# EAGLE design 150HzLPF_8GainPreamp (EAGLE 9.4.1)
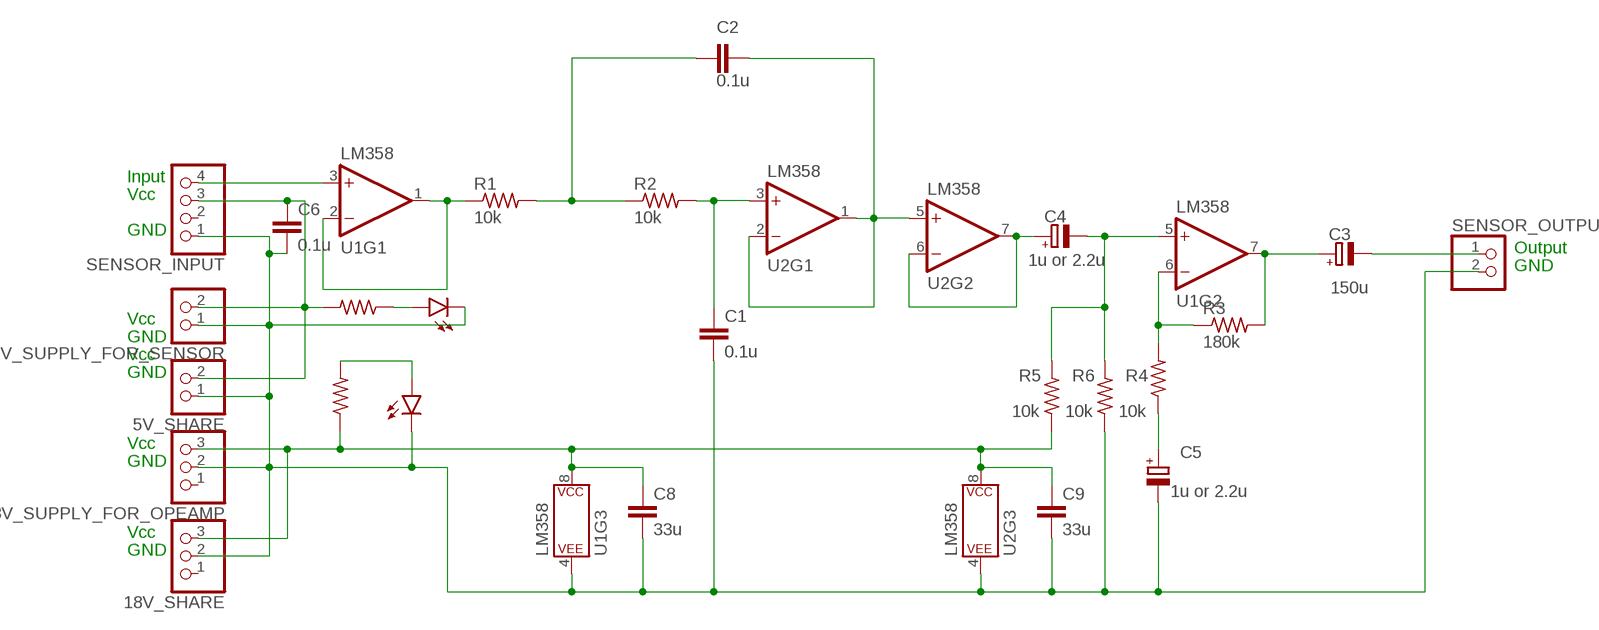
[diagram p0: schematic, sheet 1]

## Parts
5V_SHARE  PINHD-1X2  [1X02]
5V_SUPPLY_FOR_SENSOR  PINHD-1X2  [1X02]
18V_SHARE  PINHD-1X3  [1X03]
18V_SUPPLY_FOR_OPEAMP  PINHD-1X3  [1X03]
C1  0.1u  C-EU050-030X075  [C050-030X075]
C2  0.1u  C-EU050-030X075  [C050-030X075]
C3  150u  CPOL-EUE5-10.5  [E5-10,5]
C4  1u or 2.2u  CPOL-EUE5-10.5  [E5-10,5]
C5  1u or 2.2u  CPOL-EUE5-10.5  [E5-10,5]
C6  0.1u  C-EUC0603  [C0603]
C8  33u  C-EUC0603  [C0603]
C9  33u  C-EUC0603  [C0603]
D2  LTL-1CHE  [RADIAL_3MM]
D3  LTL-1CHE  [RADIAL_3MM]
R1  10k  R-US_0207/7  [0207/7]
R2  10k  R-US_0207/7  [0207/7]
R3  180k  R-US_0207/7  [0207/7]
R4  10k  R-US_0207/7  [0207/7]
R5  10k  R-US_0207/7  [0207/7]
R6  10k  R-US_0207/7  [0207/7]
R8  760  R-US_0207/7  [0207/7]
R9  3.3k  R-US_0207/7  [0207/7]
SENSOR_INPUT  PINHD-1X4  [1X04]
SENSOR_OUTPUT  PINHD-1X2  [1X02]
U1  LM358  [DIP08]
U2  LM358  [DIP08]

## Nets
5V_VCC: 5V_SHARE.2 5V_SUPPLY_FOR_SENSOR.2 C6.1 R8.2 SENSOR_INPUT.3
18V_VCC: 18V_SHARE.3 18V_SUPPLY_FOR_OPEAMP.3 C8.1 C9.1 R5.1 R9.1 U1.8(P$V+) U2.8(P$V+)
GND: 5V_SHARE.1 5V_SUPPLY_FOR_SENSOR.1 18V_SHARE.2 18V_SUPPLY_FOR_OPEAMP.2 C1.2 C5.- C6.2 C8.2 C9.2 D2.C D3.C R6.1 SENSOR_INPUT.1 SENSOR_OUTPUT.2 U1.4(P$V-) U2.4(P$V-)
N$1: R1.1 U1.1(OUT) U1.2(-IN)
N$2: C2.2 R1.2 R2.1
N$3: C1.1 R2.2 U2.3(+IN)
N$4: C2.1 U2.1(OUT) U2.2(-IN) U2.5(+IN)
N$5: SENSOR_INPUT.4 U1.3(+IN)
N$7: C4.+ U2.6(-IN) U2.7(OUT)
N$8: R3.1 R4.2 U1.6(-IN)
N$9: C3.+ R3.2 U1.7(OUT)
N$10: C4.- R5.2 R6.2 U1.5(+IN)
N$11: C5.+ R4.1
N$12: D2.A R8.1
N$13: C3.- SENSOR_OUTPUT.1
N$16: D3.A R9.2
Unconnected: 18V_SHARE.1 18V_SUPPLY_FOR_OPEAMP.1 SENSOR_INPUT.2

## Notes on the sheet
- Input
- Vcc
- GND
- Output
- GND
- Vcc
- GND
- Vcc
- GND
- Vcc
- GND
- Vcc
- GND

## Library data of the parts
5V_SHARE 5V_SUPPLY_FOR_SENSOR SENSOR_OUTPUT = pinhead:PINHD-1X2: PIN HEADER
18V_SHARE 18V_SUPPLY_FOR_OPEAMP = pinhead:PINHD-1X3: PIN HEADER
C1 C2 C6 C8 C9 = rcl:C-EU: CAPACITOR, European symbol; SPICEPREFIX: C
C3-C5 = rcl:CPOL-EU: POLARIZED CAPACITOR, European symbol; SPICEPREFIX: C
D2 D3 = LED:LTL-1CHE: LED RED DIFFUSED T/H Manufacturer's datasheet <https://media.digikey.com/pdf/Data%20Sheets/Lite-On%20PDFs/LTL-1CHEE.pdf>; CREATED_BY: PCBLayout.com; DIGIKEY_PART_NUMBER: 160-1708-ND; MANUFACTURER: Lite-On Inc.; MPN: LTL-1CHE; PACKAGE: RADIAL 3MM
R1-R6 R8 R9 = rcl:R-US_: RESISTOR, American symbol; SPICEPREFIX: R
SENSOR_INPUT = pinhead:PINHD-1X4: PIN HEADER
U1 U2 = SparkFun-IC-Amplifiers:LM358: LM358 Jellybean op-amp Datasheet <http://www.sparkfun.com/datasheets/Components/General/LM358.pdf> SparkFun Products Op-Amp (Thru-Hole) - LM358 <https://www.sparkfun.com/products/9456> (COM-09456); PROD_ID: IC-09172

## Net classes
0 default: width 0.8 mm, drill 0.2 mm, clearance 0.3 mm

## Board
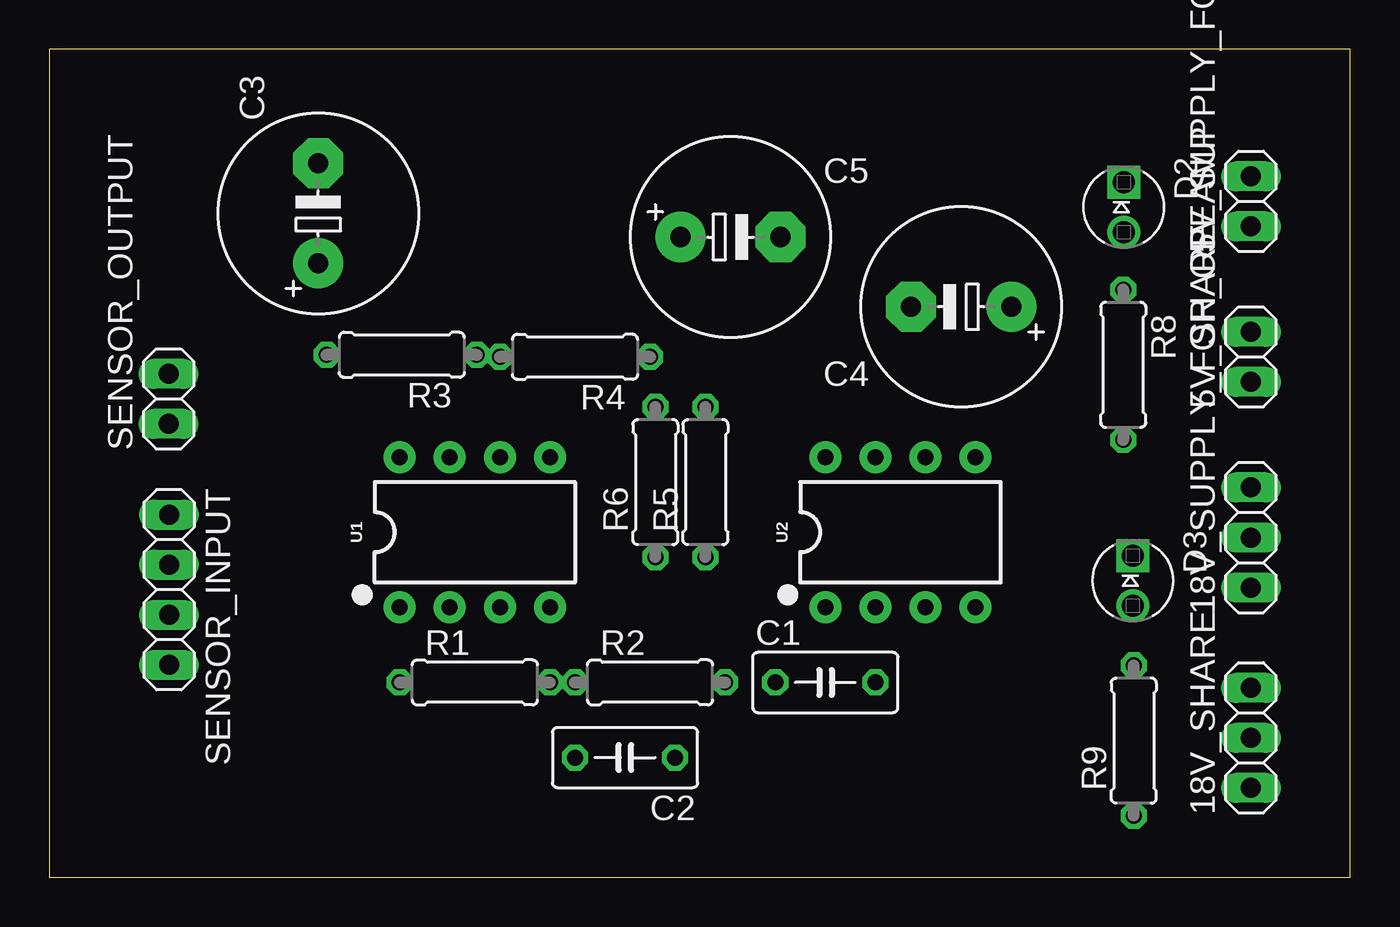
[diagram p1: board, top side]
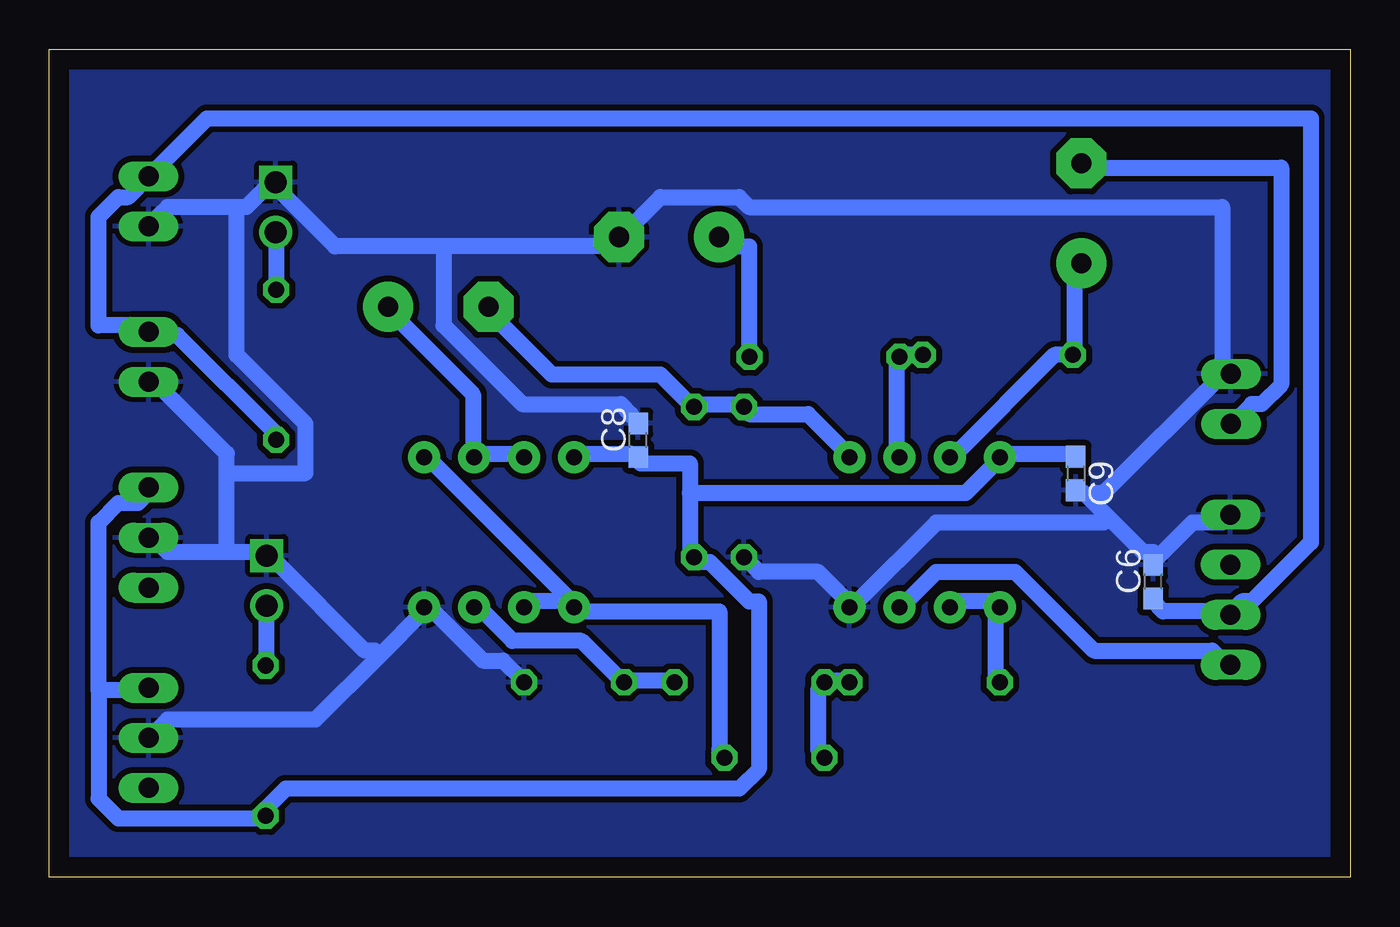
[diagram p2: board, bottom side, seen from below]

Size 66 x 42 mm. Coordinates in mm from the lower left corner, seen from the top.
Outline: 0,0 66,0 66,42 0,42 0,0
Copper layers (1*16): Top 0.035mm / dielectric 1.5mm / Bottom 0.035mm
Design rules "150HzLPF_8GainPreamp": minimum track width 6mil, minimum drill 0.35mm, track to track 0.205mm, track to pad 0.205mm, pad to pad 0.205mm, via to via 0.205mm, smd to smd 6mil, copper to edge 40mil, drill to drill 6mil, minimum pad ring 10mil, minimum via ring 8mil, stop-mask expansion 4mil, vias tented up to drill 0mil, thermal gap 10mil

### Footprints (pad centres in the part's own frame; a part is rotated, then mirrored left to right if it is on the bottom)
1X02 = drill 1.016 long: 1 -1.27,0; 2 1.27,0
1X03 = drill 1.016 long: 1 -2.54,0; 2 0,0; 3 2.54,0
C050-030X075 = drill 0.813 octagon: 1 -2.54,0; 2 2.54,0
E5-10,5 = drill 1.016 pad 2.54: + -2.54,0 | drill 1.016 pad 2.54 octagon: - 2.54,0
C0603 = smd 1.1 x 1: 1 -0.85,0; 2 0.85,0
RADIAL_3MM = drill 1.11 pad 1.67: A 1.27,0 | drill 1.11 pad 1.67 square: C -1.27,0
0207/7 = drill 0.813 octagon: 1 -3.81,0; 2 3.81,0
1X04 = drill 1.016 long: 1 -3.81,0; 2 -1.27,0; 3 1.27,0; 4 3.81,0
DIP08 = drill 0.813 pad 1.626: 1 -3.81,-3.81; 2 -1.27,-3.81; 3 1.27,-3.81; 4 3.81,-3.81; 5 3.81,3.81; 6 1.27,3.81; 7 -1.27,3.81; 8 -3.81,3.81

### Placement (x,y rotation side)
5V_SHARE  60.96,26.4 90 top
5V_SUPPLY_FOR_SENSOR  60.96,34.29 90 top
18V_SHARE  60.96,7.08 90 top
18V_SUPPLY_FOR_OPEAMP  60.96,17.24 90 top
C1  39.37,9.89 0 top
C2  29.21,6.08 180 top
C3  13.65,33.68 90 top
C4  46.26,28.94 180 top
C5  34.56,32.48 0 top
C6  10,15 90 bottom
C8  36.12,22.18 90 bottom
C9  13.93,20.49 270 bottom
D2  54.51,33.99 270 top
D3  54.97,15.05 270 top
R1  21.59,9.89 0 top
R2  30.48,9.89 0 top
R3  17.88,26.5 180 top
R4  26.67,26.4 180 top
R5  33.29,20.05 90 top
R6  30.75,20.05 90 top
R8  54.48,26 270 top
R9  55.02,6.94 90 top
SENSOR_INPUT  6.08,14.59 270 top
SENSOR_OUTPUT  6.05,24.27 90 top
U1  21.59,17.51 0 top
U2  43.18,17.51 0 top

### Tracks (layer width: path | path; a pad name or v marks a point on that pad's centre or on a via)
5V_VCC
  Bottom 0.8: C6.1 10,14 9.5,13.5 6.5,13.5 SENSOR_INPUT.3 6,13.5 5.5,14 5,14 2,17 2,38.5 58,38.5 60.5,36 5V_SUPPLY_FOR_SENSOR.2 61,35.5 62,34.5 62.5,34.5 63.5,33.5 63.5,28 61,28 5V_SHARE.2 60.5,27.5 59.5,27.5 54.5,22.5 R8.2
18V_VCC
  Bottom 0.8: 63.5,9.5 63.5,4 62.5,3 55.5,3 R9.1 55,3.5 54,4.5 31,4.5 30,5.5 30,14 30.5,14 32.5,16 33,16 R5.1 33.5,16.5 33.5,19.5 | 63.5,9.5 61,9.5 18V_SHARE.3 | 63.5,9.5 63.5,18 62.5,19 61.5,19 61,19.5 18V_SUPPLY_FOR_OPEAMP.3 | C9.1 14,21.5 17.5,21.5 U1.8 18,21 19.5,19.5 33.5,19.5 | U2.8 39,21.5 36.5,21.5 C8.1 36,21 33.5,21 33.5,19.5
GND
  Bottom 0.8: R6.1 30.5,16 30,15.5 27,15.5 25.5,14 U1.4 25,14 21,18 12.5,18 12.25,18.25 | 9.75,16.25 8,18 6.5,18 SENSOR_INPUT.1 | 9.75,16.25 10,16 C6.2 | 12.25,18.25 10.5,16.5 10,16.5 9.75,16.25 | 12.25,18.25 13.25,19.25 | 13.25,19.25 13.5,19.5 C9.2 | 13.25,19.25 13,19.5 12.5,19.5 6.5,25.5 SENSOR_OUTPUT.2 6.5,26 6.5,34 30.5,34 31,34.5 35,34.5 37,32.5 C5.- 37.5,32 46,32 | 56.5,34 56,34 55,35 D2.C 54.5,35 51.5,32 46,32 | 56.5,34 60,34 60.5,33.5 5V_SUPPLY_FOR_SENSOR.1 | 46,32 46,28 42,24 37,24 36.5,23.5 C8.2 | 57,16.5 55,16.5 D3.C 54.5,16 50,11.5 49.5,11.5 49.25,11.25 | 57,16.5 60,16.5 60.5,17 18V_SUPPLY_FOR_OPEAMP.2 | 57,16.5 57,20.5 | 57,20.5 57,21.5 60.5,25 5V_SHARE.1 | C1.2 42,10 43,11 44,11 46.5,13.5 U2.4 47,13.5 49.25,11.25 | 49.25,11.25 52.5,8 60,8 60.5,7.5 18V_SHARE.2 | 56.5,34 56.5,26.5 53,23 53,20.5 57,20.5
  pour Bottom: 0,42 0,0 66,0 66,42
N$1
  Bottom 0.8: R1.1 18,10 18,13.5 U1.1 18,14 20,14 U1.2
N$2
  Bottom 0.8: C2.2 27,6.5 27,9.5 R2.1 26.5,10 25.5,10 R1.2
N$3
  Bottom 0.8: R2.2 34.5,10 36.5,10 C1.1 37,10 39,12 42.5,12 44,13.5 U2.3
N$4
  Bottom 0.8: C2.1 32,6.5 32,13.5 39,13.5 U2.1 39.5,14 | 39.5,14 41.5,14 U2.2 | 39.5,14 46.5,21 U2.5
N$5
  Bottom 0.8: SENSOR_INPUT.4 6.5,11 7,11.5 13,11.5 17,15.5 21,15.5 22.5,14 U1.3
N$7
  Bottom 0.8: U2.7 42,21.5 44,21.5 U2.6 44.5,21.5 44.5,24.5 48.5,28.5 C4.+
N$8
  Bottom 0.8: R3.1 22.5,26.5 R4.2 23,26 23,21.5 U1.6
N$9
  Bottom 0.8: C3.+ 14,31 14,26.5 R3.2 15,26.5 20,21.5 U1.7
N$10
  Bottom 0.8: U1.5 25.5,21.5 27.5,23.5 30.5,23.5 R6.2 31,24 33,24 R5.2 33.5,24 35,25.5 40.5,25.5 43.5,28.5 C4.-
N$11
  Bottom 0.8: R4.1 30.5,26.5 30.5,32 32,32 C5.+
N$12
  Bottom 0.8: R8.1 54.5,30 54.5,32.5 D2.A
N$13
  Bottom 0.8: SENSOR_OUTPUT.1 6,23 5,24 4.5,24 3.5,25 3.5,36 13.5,36 C3.-
N$16
  Bottom 0.8: R9.2 55,11 55,13.5 D3.A